# EAGLE design eyes (EAGLE 9.6.2)
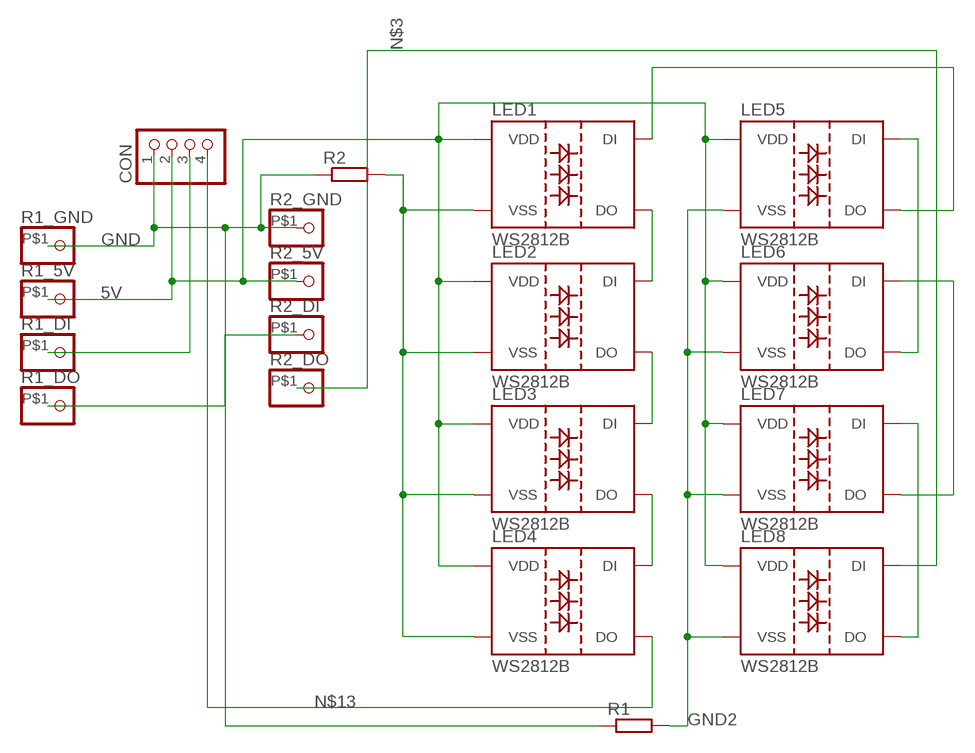
[diagram p0: schematic, sheet 1]

## Parts
CON  PINHD-1X4  [1X04]
LED1  WS2812B  [WS2812B]
LED2  WS2812B  [WS2812B]
LED3  WS2812B  [WS2812B]
LED4  WS2812B  [WS2812B]
LED5  WS2812B  [WS2812B]
LED6  WS2812B  [WS2812B]
LED7  WS2812B  [WS2812B]
LED8  WS2812B  [WS2812B]
R1  R-EU_0207/7  [0207/7]
R1_5V  PINHD-1X1-BIGPOGO  [1X1-BIGPOGO]
R1_DI  PINHD-1X1-BIGPOGO  [1X1-BIGPOGO]
R1_DO  PINHD-1X1-BIGPOGO  [1X1-BIGPOGO]
R1_GND  PINHD-1X1-BIGPOGO  [1X1-BIGPOGO]
R2  R-EU_0207/7  [0207/7]
R2_5V  PINHD-1X1-BIGPOGO  [1X1-BIGPOGO]
R2_DI  PINHD-1X1-BIGPOGO  [1X1-BIGPOGO]
R2_DO  PINHD-1X1-BIGPOGO  [1X1-BIGPOGO]
R2_GND  PINHD-1X1-BIGPOGO  [1X1-BIGPOGO]

## Nets
5V: CON.2 LED1.1(VDD) LED2.1(VDD) LED3.1(VDD) LED4.1(VDD) LED5.1(VDD) LED6.1(VDD) LED7.1(VDD) LED8.1(VDD) R1_5V.P$1 R2_5V.P$1
GND: CON.1 R1.1 R1_GND.P$1 R2.1 R2_GND.P$1
GND2: LED5.3(VSS) LED6.3(VSS) LED7.3(VSS) LED8.3(VSS) R1.2
GND3: LED1.3(VSS) LED2.3(VSS) LED3.3(VSS) LED4.3(VSS) R2.2
N$2: CON.3 R1_DI.P$1
N$3: LED8.4(DI) R2_DO.P$1
N$4: R1_DO.P$1 R2_DI.P$1
N$6: LED7.4(DI) LED8.2(DO)
N$7: LED6.4(DI) LED7.2(DO)
N$8: LED5.4(DI) LED6.2(DO)
N$10: LED1.2(DO) LED2.4(DI)
N$11: LED2.2(DO) LED3.4(DI)
N$12: LED3.2(DO) LED4.4(DI)
N$13: CON.4 LED4.2(DO)
N$14: LED1.4(DI) LED5.2(DO)

## Library data of the parts
CON = pinhead:PINHD-1X4: PIN HEADER
LED1-LED8 = WS2812:WS2812B
R1 R2 = rcl:R-EU_: RESISTOR, European symbol; SPICEPREFIX: R
R1_5V R1_DI R1_DO R1_GND R2_5V R2_DI R2_DO R2_GND = adafruit:PINHD-1X1: Pin header 1x1 for 0.1" spacing With round pins

## Board
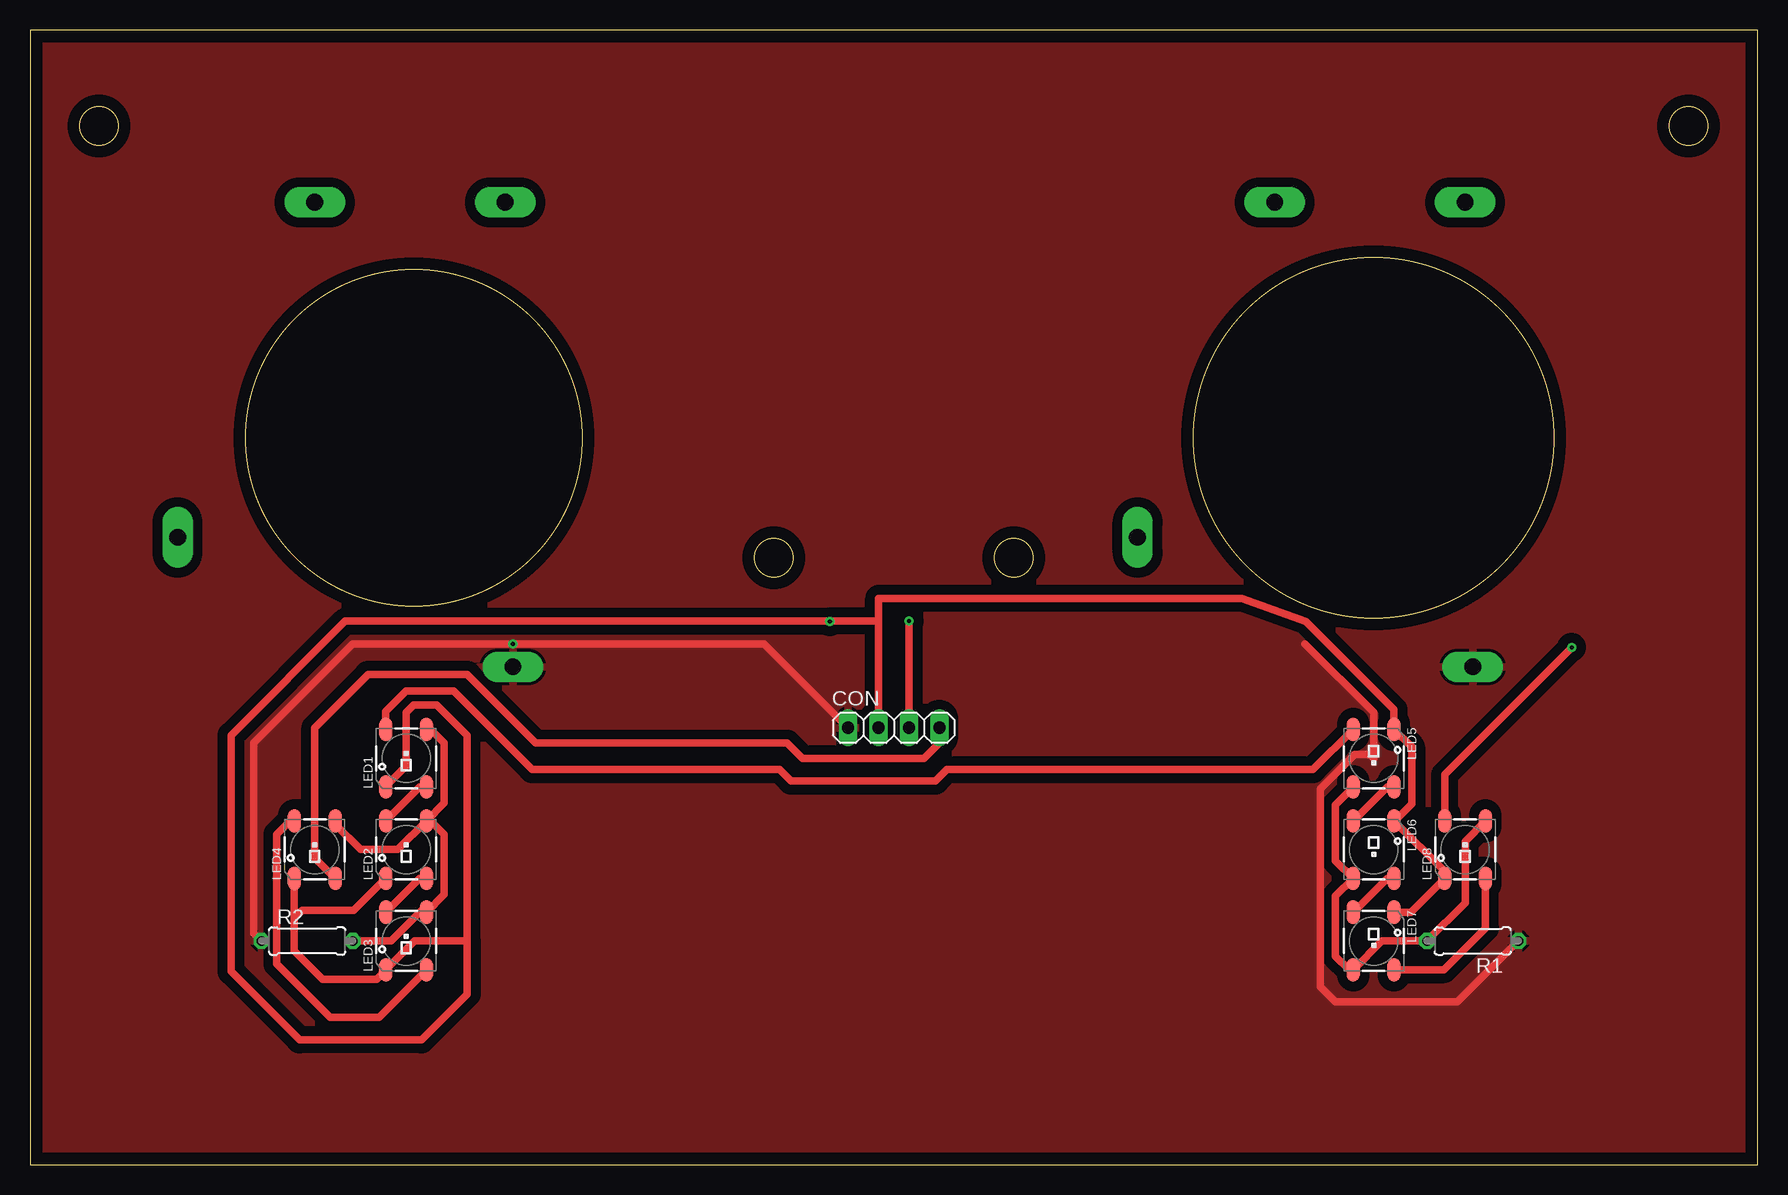
[diagram p1: board, top side]
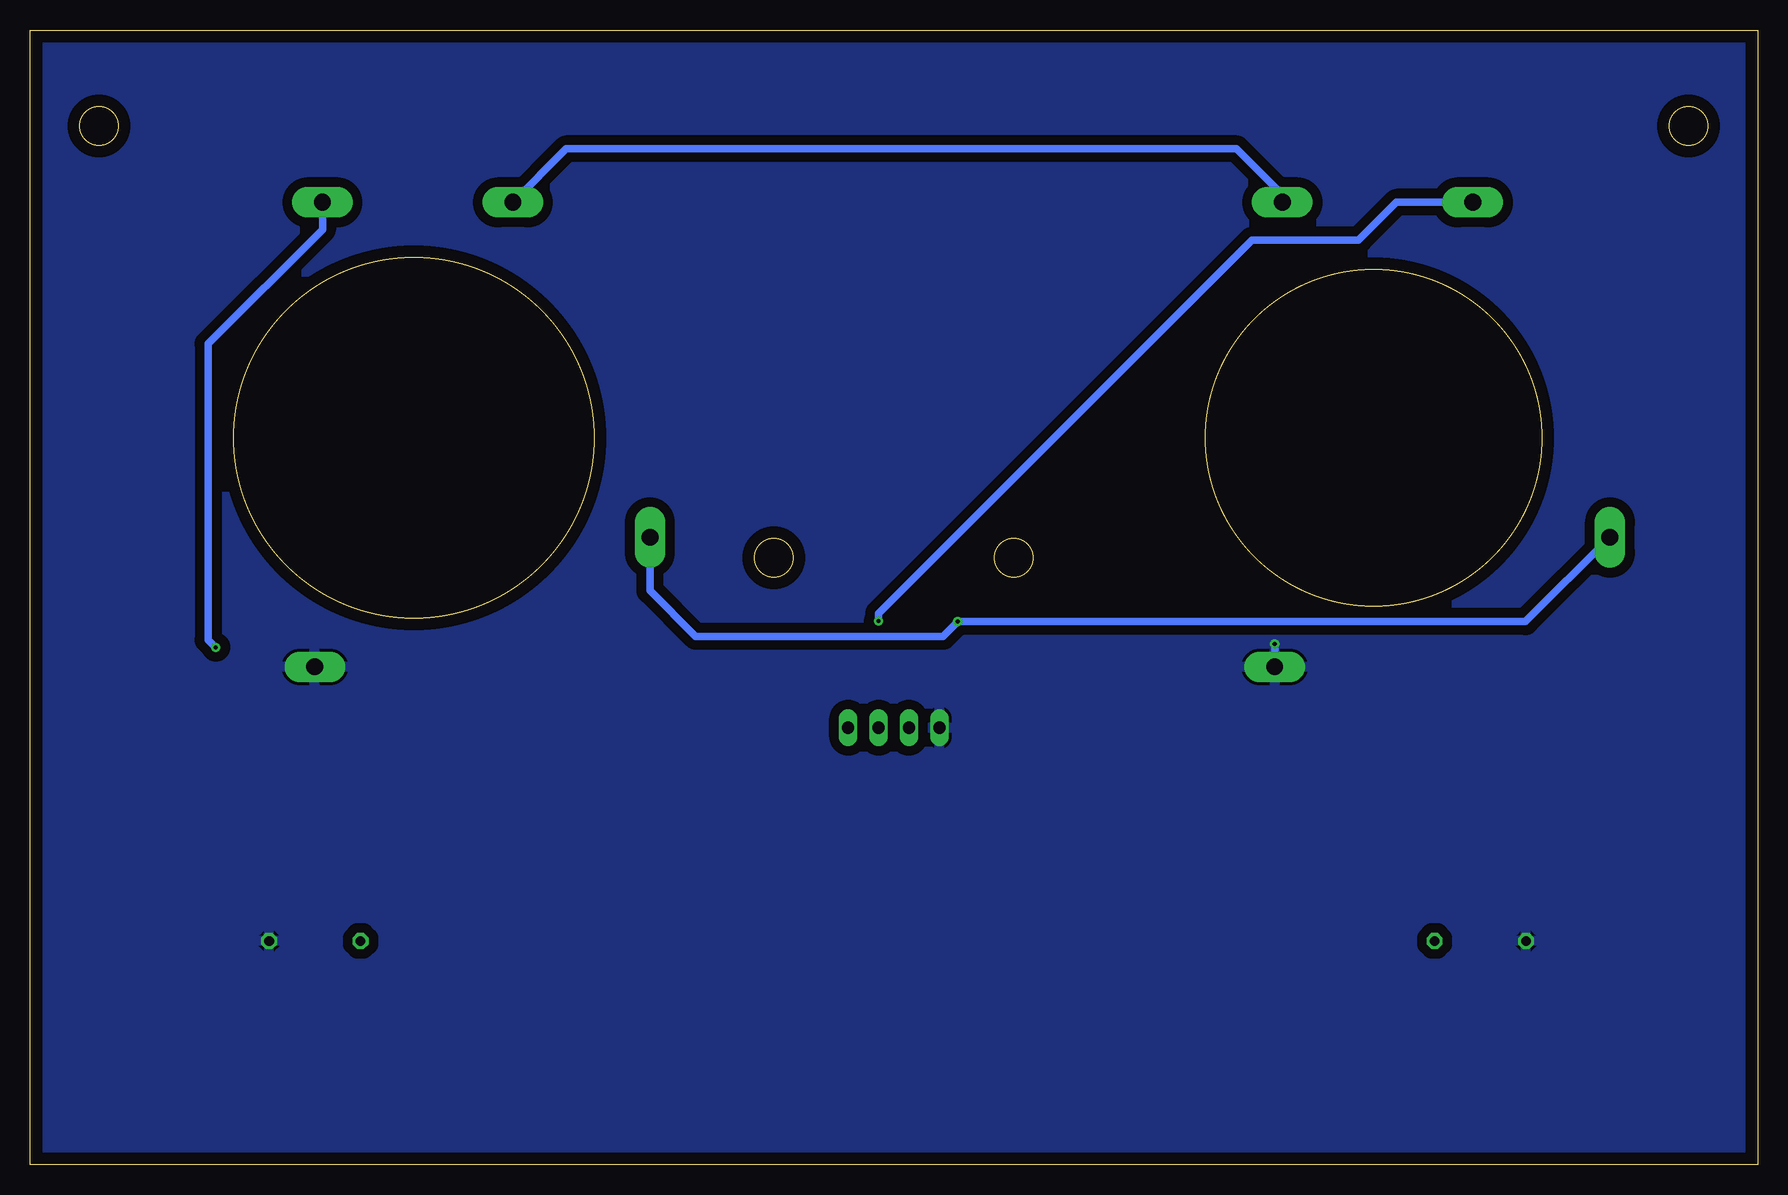
[diagram p2: board, bottom side, seen from below]

Size 144 x 94.59 mm. Coordinates in mm from the lower left corner, seen from the top.
Outline: 0,94.59 0,0 144,0 144,94.59 0,94.59
Outline: circle at 32,60.59 radius 14
Outline: circle at 5.75,86.59 radius 1.6
Outline: circle at 82,50.59 radius 1.6
Outline: circle at 138.25,86.59 radius 1.6
Outline: circle at 62,50.59 radius 1.6
Outline: circle at 112,60.59 radius 15
Copper layers (1*16): Top 0.035mm / dielectric 1.5mm / Bottom 0.035mm
Design rules "default": minimum track width 6mil, minimum drill 0.35mm, track to track 6mil, track to pad 6mil, pad to pad 6mil, via to via 6mil, smd to smd 6mil, copper to edge 40mil, drill to drill 6mil, minimum pad ring 10mil, minimum via ring 8mil, stop-mask expansion 4mil, vias tented up to drill 0mil, thermal gap 10mil

### Footprints (pad centres in the part's own frame; a part is rotated, then mirrored left to right if it is on the bottom)
1X04 = drill 1.016 long: 1 -3.81,0; 2 -1.27,0; 3 1.27,0; 4 3.81,0
WS2812B = smd 2 x 1.1: 1 -2.4,1.7; 2 -2.4,-1.7; 3 2.4,-1.7; 4 2.4,1.7
0207/7 = drill 0.813 octagon: 1 -3.81,0; 2 3.81,0
1X1-BIGPOGO = drill 1.4 pad 2.54 long: P$1 0,0

### Placement (x,y rotation side)
CON  72,36.42 0 top
LED1  31.36,33.88 90 top
LED2  31.36,26.26 90 top
LED3  31.36,18.64 90 top
LED4  23.74,26.26 90 top
LED5  112,33.88 270 top
LED6  112,26.26 270 top
LED7  112,18.64 270 top
LED8  119.62,26.26 90 top
R1  120.26,18.64 180 top
R1_5V  12.31,52.29 90 top
R1_DI  23.74,80.23 0 top
R1_DO  39.62,80.23 0 top
R1_GND  40.25,41.5 180 top
R2  23.1,18.64 0 top
R2_5V  92.32,52.29 90 top
R2_DI  103.75,80.23 0 top
R2_DO  119.62,80.23 0 top
R2_GND  120.26,41.5 0 top

### Tracks (layer width: path | path; a pad name or v marks a point on that pad's centre or on a via)
5V  (via drill 0.35)
  Top 0.61: 36.44,18.64 36.44,14.19 32.63,10.38 22.47,10.38 16.76,16.1 16.76,35.78 26.28,45.31 66.62,45.31 | 66.62,45.31 v66.66,45.27 | LED7.1 115.1,21.04 LED8.1 117.92,24.44 LED6.1 113.77,28.66 115.18,30.07 115.18,34.8 LED5.1 113.7,37.94 106.38,45.27 101.03,47.21 70.73,47.21 70.73,45.31 | 36.44,18.64 32.06,18.64 LED3.1 28.88,15.46 24.38,15.46 22.04,17.8 22.04,20.54 | 22.04,20.54 LED4.1 | 36.44,18.64 36.44,35.78 33.9,38.32 31.99,38.32 31.36,37.69 31.36,33.24 29.66,31.54 LED1.1 | 22.04,20.54 22.67,21.18 26.98,21.18 LED2.1 | 70.73,45.31 66.62,45.31 | CON.2 70.73,45.31
  Bottom 0.61: R1_5V.P$1 19.34,45.27 v66.66,45.27 67.89,44.04 88.51,44.04 92.32,47.85 R2_5V.P$1
GND  (via drill 0.35)
  Top 0.61: R1.1 118.99,13.56 108.83,13.56 107.56,14.83 107.56,31.34 110.42,34.2 111.69,34.2 112,33.88 112,37.69 106.29,43.4 | R2.1 18.66,19.27 18.66,35.15 26.91,43.4 v40.25,43.4 61.2,43.4 CON.1
  Bottom 0.61: R1_GND.P$1 v40.25,43.4
  pour Top (isolate 0.813): 0.25,94.2 143.75,94.2 143.75,0.22 0.25,0.22
  pour Bottom (isolate 0.813): 143.75,94.2 0.25,94.2 0.25,0.22 143.75,0.22
GND2
  Top 0.61: LED5.3 108.83,30 108.83,25.33 LED6.3 108.83,22.38 108.83,17.37 109.96,16.24 LED7.3 112.7,18.64 R1.2 119.62,21.81 119.62,26.96 LED8.3
GND3
  Top 0.61: R2.2 30.09,18.64 32.63,21.18 32.92,21.18 LED3.3 34.53,22.51 34.53,27.53 33.41,28.66 LED2.3 | LED2.3 34.53,30.13 34.53,35.15 33.41,36.28 LED1.3 | LED2.3 30.66,26.26 27.55,26.26 25.44,28.37 LED4.3
N$2  (via drill 0.35)
  Top 0.61: v73.27,45.31 CON.3
  Bottom 0.61: R1_DI.P$1 30.09,80.23 33.27,77.06 42.16,77.06 73.27,45.94 v73.27,45.31
N$3  (via drill 0.35)
  Top 0.61: LED8.4 117.92,32.52 v128.51,43.11
  Bottom 0.61: R2_DO.P$1 119.62,77.95 129.15,68.42 129.15,43.75 v128.51,43.11
N$4
  Bottom 0.61: R2_DI.P$1 99.31,84.68 43.42,84.68 39.62,80.87 R1_DO.P$1
N$6
  Top 0.61: LED7.4 117.86,16.24 121.33,19.7 LED8.2
N$7
  Top 0.61: LED7.2 113.12,23.86 LED6.4
N$8
  Top 0.61: LED6.2 113.12,31.48 LED5.4
N$10
  Top 0.61: LED2.4 32.48,31.48 LED1.2
N$11
  Top 0.61: LED3.4 32.48,23.86 LED2.2
N$12
  Top 0.61: LED4.4 21.7,28.66 20.56,27.53 20.56,16.73 25.01,12.29 29.11,12.29 LED3.2
N$13
  Top 0.61: LED4.2 23.74,25.56 23.74,36.42 28.19,40.86 36.44,40.86 42.16,35.15 63.11,35.15 64.38,33.88 74.54,33.88 75.81,35.15 CON.4
N$14
  Top 0.61: LED1.4 29.66,37.77 31.36,39.47 35.3,39.47 41.84,32.93 62.48,32.93 63.43,31.97 75.49,31.97 76.44,32.93 106.95,32.93 LED5.2